# EAGLE design BLDC_Motor_Driver_mb (EAGLE 9.6.2)
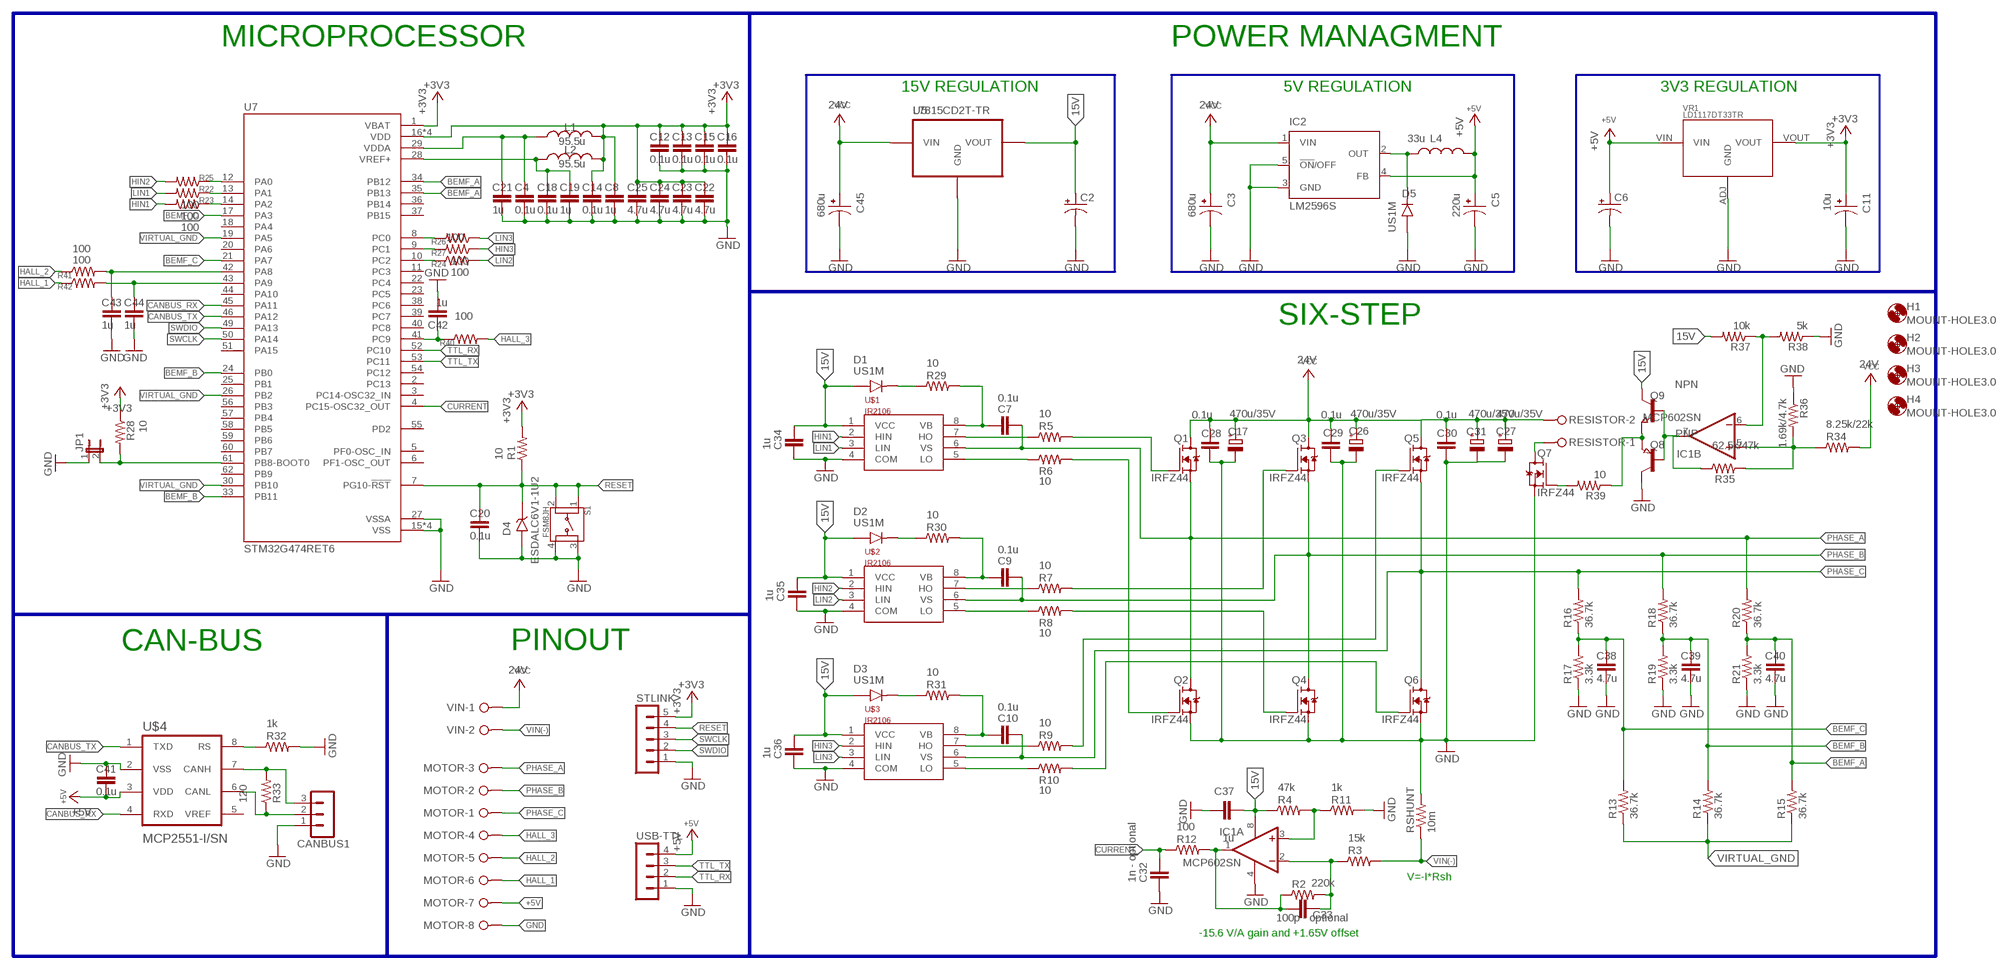
[diagram p0: schematic, sheet 1]

## Parts
C2  CPOL-US153CLV-0405  [153CLV-0405]
C3  680u  EEEFK1H221P  [CAP_EEEFK1H221P]
C4  0.1u  C-EUC1206  [C1206]
C5  220u  EEEFK1H221P  [CAP_EEEFK1H221P]
C6  CPOL-US153CLV-0405  [153CLV-0405]
C7  0.1u  C-EUC1206  [C1206]
C8  1u  C-EUC1206  [C1206]
C9  0.1u  C-EUC1206  [C1206]
C10  0.1u  C-EUC1206  [C1206]
C11  10u  EEEFK1H221P  [CAP_EEEFK1H221P]
C12  0.1u  C-EUC1206  [C1206]
C13  0.1u  C-EUC1206  [C1206]
C14  0.1u  C-EUC1206  [C1206]
C15  0.1u  C-EUC1206  [C1206]
C16  0.1u  C-EUC1206  [C1206]
C17  470u/35V  CPOL-EUE7.5-16  [E7,5-16]
C18  0.1u  C-EUC1206  [C1206]
C19  1u  C-EUC1206  [C1206]
C20  0.1u  C-EUC1206  [C1206]
C21  1u  C-EUC1206  [C1206]
C22  4.7u  C-EUC1206  [C1206]
C23  4.7u  C-EUC1206  [C1206]
C24  4.7u  C-EUC1206  [C1206]
C25  4.7u  C-EUC1206  [C1206]
C26  470u/35V  CPOL-EUE7.5-16  [E7,5-16]
C27  470u/35V  CPOL-EUE7.5-16  [E7,5-16]
C28  0.1u  C-EUC1206  [C1206]
C29  0.1u  C-EUC1206  [C1206]
C30  0.1u  C-EUC1206  [C1206]
C31  470u/35V  CPOL-EUE7.5-16  [E7,5-16]
C32  1n - optional  C-EUC1206  [C1206]
C33  100p - optional  C-EUC1206  [C1206]
C34  1u  C-EUC1206  [C1206]
C35  1u  C-EUC1206  [C1206]
C36  1u  C-EUC1206  [C1206]
C37  1u  C-EUC1206  [C1206]
C38  4.7u  C-EUC1206  [C1206]
C39  4.7u  C-EUC1206  [C1206]
C40  4.7u  C-EUC1206  [C1206]
C41  0.1u  C-EUC1206  [C1206]
C42  1u  C-EUC1206  [C1206]
C43  1u  C-EUC1206  [C1206]
C44  1u  C-EUC1206  [C1206]
C45  680u  EEEFK1H221P  [CAP_EEEFK1H221P]
CANBUS1  MA03-1  [MA03-1]
D1  US1M  [DIOM4325X250N]
D2  US1M  [DIOM4325X250N]
D3  US1M  [DIOM4325X250N]
D4  ESDALC6V1-1U2  [DIODE_ESDALC6V1-1U2]
D5  US1M  [DIOM4325X250N]
H1  MOUNT-HOLE3.0  [3,0]
H2  MOUNT-HOLE3.0  [3,0]
H3  MOUNT-HOLE3.0  [3,0]
H4  MOUNT-HOLE3.0  [3,0]
IC1  MCP602SN  [SO08]
IC2  LM2596S  [TO263-5]
JP1  JP1E  [JP1]
L1  95.5u  L-USL3225P  [L3225P]
L2  95.5u  L-USL3225P  [L3225P]
L4  33u  IHLP4040  [IHLP4040]
MOTOR  W237-08P  [W237-8P]
Q1  IRFZ44  IRFZ44NSTRRPBF  [DPAK254P1524X483-3N]
Q2  IRFZ44  IRFZ44NSTRRPBF  [DPAK254P1524X483-3N]
Q3  IRFZ44  IRFZ44NSTRRPBF  [DPAK254P1524X483-3N]
Q4  IRFZ44  IRFZ44NSTRRPBF  [DPAK254P1524X483-3N]
Q5  IRFZ44  IRFZ44NSTRRPBF  [DPAK254P1524X483-3N]
Q6  IRFZ44  IRFZ44NSTRRPBF  [DPAK254P1524X483-3N]
Q7  IRFZ44  IRFZ44NSTRRPBF  [DPAK254P1524X483-3N]
Q8  PNP  PNP-TRANSISTOR_SOT23  [SOT23]
Q9  NPN  NPN-TRANSISTOR_SOT23  [SOT23]
R1  10  R-US_R1206  [R1206]
R2  220k  R-US_R1206  [R1206]
R3  15k  R-US_R1206  [R1206]
R4  47k  R-US_R1206  [R1206]
R5  10  R-US_R1206  [R1206]
R6  10  R-US_R1206  [R1206]
R7  10  R-US_R1206  [R1206]
R8  10  R-US_R1206  [R1206]
R9  10  R-US_R1206  [R1206]
R10  10  R-US_R1206  [R1206]
R11  1k  R-US_R1206  [R1206]
R12  100  R-US_R1206  [R1206]
R13  36.7k  R-US_R1206  [R1206]
R14  36.7k  R-US_R1206  [R1206]
R15  36.7k  R-US_R1206  [R1206]
R16  36.7k  R-US_R1206  [R1206]
R17  3.3k  R-US_R1206  [R1206]
R18  36.7k  R-US_R1206  [R1206]
R19  3.3k  R-US_R1206  [R1206]
R20  36.7k  R-US_R1206  [R1206]
R21  3.3k  R-US_R1206  [R1206]
R22  100  R-US_R1206  [R1206]
R23  100  R-US_R1206  [R1206]
R24  100  R-US_R1206  [R1206]
R25  100  R-US_R1206  [R1206]
R26  100  R-US_R1206  [R1206]
R27  100  R-US_R1206  [R1206]
R28  10  R-US_R1206  [R1206]
R29  10  R-US_R1206  [R1206]
R30  10  R-US_R1206  [R1206]
R31  10  R-US_R1206  [R1206]
R32  1k  R-US_R1206  [R1206]
R33  120  R-US_R1206  [R1206]
R34  8.25k/22k  R-US_R1206  [R1206]
R35  62.5k/47k  R-US_R1206  [R1206]
R36  1.69k/4.7k  R-US_R1206  [R1206]
R37  10k  R-US_R1206  [R1206]
R38  5k  R-US_R1206  [R1206]
R39  10  R-US_R1206  [R1206]
R40  100  R-US_R1206  [R1206]
R41  100  R-US_R1206  [R1206]
R42  100  R-US_R1206  [R1206]
RESISTOR  W237-02P  [W237-132]
RSHUNT  10m  R-US_R1210  [R1210]
S1  FSM8JH  [SW_FSM8JH]
STLINK  MA05-1  [MA05-1]
U5  L7815CD2T-TR  [D2PAK]
U7  STM32G474RET6  [QFP50P1200X1200X160-64N]
U$1  IR2106  [SOIC-8]
U$2  IR2106  [SOIC-8]
U$3  IR2106  [SOIC-8]
U$4  MCP2551-I/SN  [SOIC127P599X175-8N]
USB-TTL  MA04-1  [MA04-1]
VIN  W237-02P  [W237-132]
VR1  LD1117DT33TR  [DPAK456P1010X240-3N]

## Nets
15V: C2.+ C34.2 C35.2 C36.2 C37.1 D1.A D2.A D3.A IC1.8(P:V+) Q9.3(C) R4.1 R37.2 U5.VOUT U$1.1(VCC) U$2.1(VCC) U$3.1(VCC)
+3V3: C8.1 C11.1 C12.1 C13.1 C14.1 C15.1 C16.1 C22.1 C23.1 C24.1 C25.1 L1.2 L2.2 R1.2 R28.1 STLINK.5 U7.1(VBAT) U7.16(VDD) U7.32(VDD) U7.48(VDD) U7.64(VDD) VR1.VOUT
+5V: C5.1 C6.+ C41.2 IC2.4(FB) L4.2 MOTOR.7 U$4.3(VDD) USB-TTL.4 VR1.VIN
BEMF_A: C40.1 R15.2 R20.1 R21.2 U7.34(PB12) U7.35(PB13)
BEMF_B: C39.1 R14.2 R18.1 R19.2 U7.24(PB0) U7.33(PB11)
BEMF_C: C38.1 R13.2 R16.1 R17.2 U7.17(PA3) U7.21(PA7)
CANBUS_RX: U7.45(PA11) U$4.4(RXD)
CANBUS_TX: U7.46(PA12) U$4.1(TXD)
CURRENT: C32.2 R12.1 U7.4(PC15-OSC32_OUT)
GND: C2.- C3.2 C4.2 C5.2 C6.- C8.2 C11.2 C12.2 C13.2 C14.2 C15.2 C16.2 C17.- C18.2 C19.2 C20.2 C21.2 C22.2 C23.2 C24.2 C25.2 C26.- C27.- C28.2 C29.2 C30.2 C31.- C32.1 C34.1 C35.1 C36.1 C37.2 C38.2 C39.2 C40.2 C41.1 C42.2 C43.2 C44.2 C45.2 CANBUS1.1 D4.2(A) D5.A IC1.4(P:V-) IC2.3(GND) IC2.5(!ON!/OFF) JP1.1 MOTOR.8 Q2.3(S) Q4.3(S) Q6.3(S) Q7.3(S) Q8.3(C) R11.2 R17.1 R19.1 R21.1 R32.2 R36.1 R38.1 RSHUNT.2 S1.3 S1.4 STLINK.1 U5.GND U7.15(VSS) U7.27(VSSA) U7.31(VSS) U7.47(VSS) U7.63(VSS) U$1.4(COM) U$2.4(COM) U$3.4(COM) U$4.2(VSS) USB-TTL.1 VR1.ADJ(GND)
HALL_1: MOTOR.6 R42.1
HALL_2: MOTOR.5 R41.1
HALL_3: MOTOR.4 R40.2
HIN1: R23.2 U$1.2(HIN)
HIN2: R25.2 U$2.2(HIN)
HIN3: R27.1 U$3.2(HIN)
HS2: Q3.1(G) R7.2
HS3: Q5.1(G) R9.2
LIN1: R22.2 U$1.3(LIN)
LIN2: R24.2 U$2.3(LIN)
LIN3: R26.1 U$3.3(LIN)
LS1: Q2.1(G) R6.2
LS2: Q4.1(G) R8.2
LS3: Q6.1(G) R10.2
N$1: Q1.1(G) R5.2
N$2: C4.1 C21.1 L1.1 U7.29(VDDA)
N$3: R6.1 U$1.5(LO)
N$4: C9.1 R30.2 U$2.8(VB)
N$5: R5.1 U$1.7(HO)
N$6: R26.2 U7.8(PC0)
N$7: D1.C(K) R29.1
N$8: C7.1 R29.2 U$1.8(VB)
N$9: R27.2 U7.9(PC1)
N$10: R7.1 U$2.7(HO)
N$11: R8.1 U$2.5(LO)
N$12: JP1.2 R28.2 U7.61(PB8-BOOT0)
N$13: C33.1 IC1.2(A:-IN) R2.2 R3.1
N$14: IC1.3(A:+IN) R4.2 R11.1
N$15: C10.1 R31.2 U$3.8(VB)
N$16: IC1.7(B:OUT) Q8.1(B) Q9.1(B) R35.1
N$17: R9.1 U$3.7(HO)
N$18: R10.1 U$3.5(LO)
N$19: D2.C(K) R30.1
N$20: C18.1 C19.1 L2.1 U7.28(VREF+)
N$21: C33.2 IC1.1(A:OUT) R2.1 R12.2
N$22: D5.C(K) IC2.2(OUT) L4.1
N$23: R22.1 U7.13(PA1)
N$24: R23.1 U7.14(PA2)
N$25: R24.1 U7.10(PC2)
N$26: R25.1 U7.12(PA0)
N$27: D3.C(K) R31.1
N$28: R32.1 U$4.8(RS)
N$29: IC1.5(B:+IN) R34.1 R35.2 R36.2
N$30: CANBUS1.3 R33.2 U$4.7(CANH)
N$31: Q7.2(D) RESISTOR.1
N$32: CANBUS1.2 R33.1 U$4.6(CANL)
N$33: IC1.6(B:-IN) R37.1 R38.2
N$34: Q8.2(E) Q9.2(E) R39.1
N$35: Q7.1(G) R39.2
N$36: C42.1 R40.1 U7.41(PC9)
N$37: C43.1 R41.2 U7.42(PA8)
N$38: C44.1 R42.2 U7.43(PA9)
PHASE_A: C7.2 MOTOR.3 Q1.3(S) Q2.2(D) R20.2 U$1.6(VS)
PHASE_B: C9.2 MOTOR.2 Q3.3(S) Q4.2(D) R18.2 U$2.6(VS)
PHASE_C: C10.2 MOTOR.1 Q5.3(S) Q6.2(D) R16.2 U$3.6(VS)
RESET: C20.1 D4.1(K) R1.1 S1.1 S1.2 STLINK.4 U7.7(PG10-!RST)
SWCLK: STLINK.3 U7.50(PA14)
SWDIO: STLINK.2 U7.49(PA13)
TTL_RX: U7.52(PC10) USB-TTL.2
TTL_TX: U7.53(PC11) USB-TTL.3
VCC: C3.1 C17.+ C26.+ C27.+ C28.1 C29.1 C30.1 C31.+ C45.1 IC2.1(VIN) Q1.2(D) Q3.2(D) Q5.2(D) R34.2 RESISTOR.2 U5.VIN VIN.1 ; supply symbol labelled 24V
VIN(-): R3.2 RSHUNT.1 VIN.2
VIRTUAL_GND: R13.1 R14.1 R15.1 U7.19(PA5) U7.26(PB2) U7.30(PB10)
Unconnected: U7.2(PC13) U7.3(PC14-OSC32_IN) U7.5(PF0-OSC_IN) U7.6(PF1-OSC_OUT) U7.11(PC3) U7.18(PA4) U7.20(PA6) U7.22(PC4) U7.23(PC5) U7.25(PB1) U7.36(PB14) U7.37(PB15) U7.38(PC6) U7.39(PC7) U7.40(PC8) U7.44(PA10) U7.51(PA15) U7.54(PC12) U7.55(PD2) U7.56(PB3) U7.57(PB4) U7.58(PB5) U7.59(PB6) U7.60(PB7) U7.62(PB9) U$4.5(VREF)

## Buses
B$2
B$3
B$1
B$6
B$5

## Notes on the sheet
- MICROPROCESSOR | POWER MANAGMENT
- 15V REGULATION | 5V REGULATION | 3V3 REGULATION
- SIX-STEP
- CAN-BUS | PINOUT
- V=-I*Rsh
- -15.6 V/A gain and +1.65V offset

## Library data of the parts
C2 C6 = rcl:CPOL-US: POLARIZED CAPACITOR, American symbol; SPICEPREFIX: C
C3 C5 C11 C45 = EEEFK1H221P:EEEFK1H221P; CHECK_PRICES: https://www.snapeda.com/parts/EEE-FK1H221P/Panasonic+Electronic+Components/view-part/?ref=eda; DESCRIPTION: Electrolytic capacitor SMD 220 µF 50 V 20 % (Ø x H) 10 mm x 10.2 mm Panasonic EEEFK1H221P 1 pc(s); MF: Panasonic; MP: EEE-FK1H221P; PACKAGE: RADIAL-2 Panasonic; PURCHASE-URL: https://www.snapeda.com/api/url_track_click_mouser/?unipart_id=125117&manufacturer=Panasonic&part_name=EEE-FK1H221P&search_term=smd capacitor 10mm; RS_COMPONENTS_5370584P_PURCHASE_URL: https://www.snapeda.com/api/url_track_click/https%253A//uk.rs-online.com/web/p/aluminium-capacitors/5370584p//%253Futm_campaign%253Dbuynow%2526utm_medium%253Daggregator%2526utm_source%253Dsnapeda%2526cm_mmc%253Daff-_-uk-_-snapeda-_-5370584P/?unipart_id=125117&manufacturer=Panasonic&part_name=EEE-FK1H221P&search_term=smd capacitor 10mm; RS_COMPONENTS_5370584_PURCHASE_URL: https://www.snapeda.com/api/url_track_click/https%253A//uk.rs-online.com/web/p/aluminium-capacitors/5370584//%253Futm_campaign%253Dbuynow%2526utm_medium%253Daggregator%2526utm_source%253Dsnapeda%2526cm_mmc%253Daff-_-uk-_-snapeda-_-5370584/?unipart_id=125117&manufacturer=Panasonic&part_name=EEE-FK1H221P&search_term=smd capacitor 10mm; RS_COMPONENTS_7479080_PURCHASE_URL: https://www.snapeda.com/api/url_track_click/https%253A//uk.rs-online.com/web/p/aluminium-capacitors/7479080//%253Futm_campaign%253Dbuynow%2526utm_medium%253Daggregator%2526utm_source%253Dsnapeda%2526cm_mmc%253Daff-_-uk-_-snapeda-_-7479080/?unipart_id=125117&manufacturer=Panasonic&part_name=EEE-FK1H221P&search_term=smd capacitor 10mm; SNAPEDA_LINK: https://www.snapeda.com/parts/EEE-FK1H221P/Panasonic+Electronic+Components/view-part/?ref=snap
C4 C7-C10 C12-C16 C18-C25 C28-C30 C32-C44 = rcl:C-EU: CAPACITOR, European symbol; SPICEPREFIX: C
C17 C26 C27 C31 = rcl:CPOL-EU: POLARIZED CAPACITOR, European symbol; SPICEPREFIX: C
CANBUS1 = con-lstb:MA03-1: PIN HEADER; OC_FARNELL: unknown; OC_NEWARK: unknown
D1-D3 D5 = DIODE_SMD:US1M: Check availability <https://pricing.snapeda.com/parts/US1M/Taiwan%20Semiconductor/view-part?ref=eda>; AVAILABILITY: In Stock; DESCRIPTION: 75ns, 1A, 1000V, High Efficient Recovery Rectifier; MF: Taiwan Semiconductor; MP: US1M; PACKAGE: SMA-2 Taiwan Semiconductor; PRICE: None
D4 = ESDALC6V1-1U2:ESDALC6V1-1U2: Check availability <https://pricing.snapeda.com/parts/ESDALC6V1-1U2/STMicroelectronics/view-part?ref=eda>; AVAILABILITY: In Stock; CHECK_PRICES: https://www.snapeda.com/parts/ESDALC6V1-1U2/STMicroelectronics/view-part/?ref=eda; DESCRIPTION: - Clamp - Ipp Tvs Diode Surface Mount ST0201; MF: STMicroelectronics; MP: ESDALC6V1-1U2; PACKAGE: 0201 STMicroelectronics; PRICE: None; SNAPEDA_LINK: https://www.snapeda.com/parts/ESDALC6V1-1U2/STMicroelectronics/view-part/?ref=snap
H1-H4 = holes:MOUNT-HOLE: MOUNTING HOLE with drill center marker
IC1 = linear:MCP602: Single Op Amp 2.7V to 6.0V Single Supply CMOS Source: http://ww1.microchip.com/downloads/en/DeviceDoc/21314g.pdf
IC2 = national-semiconductor:LM2596: SIMPLE SWITCHER® Power Converter 150 kHz 3A Step-Down Voltage Regulator Source: http://www.national.com/ds/LM/LM2596.pdf; MF: NATIONAL SEMICONDUCTOR; MPN: LM2596S-ADJ/NOPB; OC_FARNELL: 9494367; OC_NEWARK: 41K3842
JP1 = jumper:JP1E: JUMPER
L1 L2 = rcl:L-US: INDUCTOR, American symbol; SPICEPREFIX: L
L4 = smd-inductors:IHLP4040
MOTOR = con-wago-508:W237-08P: WAGO SREW CLAMP; OC_FARNELL: unknown; OC_NEWARK: unknown
Q1-Q7 = IRFZ44NSTRRPBF:IRFZ44NSTRRPBF: N-Channel 55V 49A (Tc) 3.8W (Ta), 94W (Tc) Surface Mount D2PAK Check availability <https://pricing.snapeda.com/parts/IRFZ44NSTRRPBF/Infineon%20Technologies/view-part?ref=eda>; AVAILABILITY: In Stock; CHECK_PRICES: https://www.snapeda.com/parts/IRFZ44NSTRRPBF/Infineon+Technologies/view-part/?ref=eda; DESCRIPTION: RoHS Compliant | Low RDS(on) | Industry-leading quality | Dynamic dv/dt Rating | Fast Switching | Fully Avalanche Rated | 175C Operating Temperature; MF: Infineon Technologies; MP: IRFZ44NSTRRPBF; PACKAGE: D2PAK Infineon; PRICE: None; SNAPEDA_LINK: https://www.snapeda.com/parts/IRFZ44NSTRRPBF/Infineon+Technologies/view-part/?ref=snap
Q8 = semicon-smd-ipc:PNP-TRANSISTOR_: PNP TRANSISTOR
Q9 = semicon-smd-ipc:NPN-TRANSISTOR_: NPN TRANSISTOR
R1-R42 RSHUNT = rcl:R-US_: RESISTOR, American symbol; SPICEPREFIX: R
RESISTOR VIN = con-wago-508:W237-02P: WAGO SREW CLAMP; OC_FARNELL: unknown; OC_NEWARK: unknown
S1 = PUSH_BUTTON:FSM8JH: Switch, Pushbutton, Tactile, SPST, Thru Hole, Vertical, 6MM, Black Check availability <https://pricing.snapeda.com/parts/FSM8JH/TE%20Connectivity/view-part?ref=eda>; AVAILABILITY: In Stock; CHECK_PRICES: https://www.snapeda.com/parts/FSM8JH/TE+Connectivity+ALCOSWITCH+Switches/view-part/?ref=eda; DESCRIPTION: Switch,Pushbutton,Tactile,SPST,Thru Hole,Vertical,6MM,Black | TE Connectivity FSM8JH; MF: TE Connectivity; MP: FSM8JH; PACKAGE: None; PRICE: None; SNAPEDA_LINK: https://www.snapeda.com/parts/FSM8JH/TE+Connectivity+ALCOSWITCH+Switches/view-part/?ref=snap
STLINK = con-lstb:MA05-1: PIN HEADER; OC_FARNELL: unknown; OC_NEWARK: unknown
U5 = L7815CD2T-TR:L7815CD2T-TR: http://www.mouser.com/ProductDetail/STMicroelectronics/L4940D2T12-TR/?qs=sGAEpiMZZMsGz1a6aV8DcKREcVcP%2fiKiVDVM5jQw8rM%3d Check availability <https://pricing.snapeda.com/parts/L7815CD2T-TR/STMicroelectronics/view-part?ref=eda>; AVAILABILITY: In Stock; CHECK_PRICES: https://www.snapeda.com/parts/L7815CD2T-TR/STMicroelectronics/view-part/?ref=eda; DESCRIPTION: Linear Voltage Regulator IC Positive Fixed 1 Output 1.5A D2PAK; MF: STMicroelectronics; MP: L7815CD2T-TR; PACKAGE: D2PAK STMicroelectronics; PRICE: None; SNAPEDA_LINK: https://www.snapeda.com/parts/L7815CD2T-TR/STMicroelectronics/view-part/?ref=snap
U7 = STM32G474RET6:STM32G474RET6; CHECK_PRICES: https://www.snapeda.com/parts/STM32G474RET6/STMicroelectronics/view-part/?ref=eda; DESCRIPTION: ARM® Cortex®-M4F STM32G4 Microcontroller IC 32-Bit Single-Core 170MHz 512KB (512K x 8) FLASH 64-LQFP (10x10); DIGIKEY_PART_NUMBER: 497-STM32G474RET6-ND; MF: STMicroelectronics; MP: STM32G474RET6; PACKAGE: LQFP-64 STMicroelectronics; SNAPEDA_LINK: https://www.snapeda.com/parts/STM32G474RET6/STMicroelectronics/view-part/?ref=snap
U$1-U$3 = mutlu:IR2106
U$4 = MCP2551-I_SN:MCP2551-I/SN: Check availability <https://pricing.snapeda.com/parts/MCP2551-I/SN/Microchip/view-part?ref=eda>; AVAILABILITY: In Stock; CHECK_PRICES: https://www.snapeda.com/parts/MCP2551-I/SN/Microchip/view-part/?ref=eda; DESCRIPTION: Microchip CAN Transceiver1Mbit/s 1-channel ISO 11898 8-Pin SOIC | Microchip Technology Inc. MCP2551-I/SN; MF: Microchip; MP: MCP2551-I/SN; PACKAGE: SOIC-8 Microchip; PRICE: None; PURCHASE-URL: https://www.snapeda.com/api/url_track_click_mouser/?unipart_id=10929&manufacturer=Microchip&part_name=MCP2551-I/SN&search_term=mcp2551; SNAPEDA_LINK: https://www.snapeda.com/parts/MCP2551-I/SN/Microchip/view-part/?ref=snap
USB-TTL = con-lstb:MA04-1: PIN HEADER; OC_FARNELL: unknown; OC_NEWARK: unknown
VR1 = LD1117DT33TR:LD1117DT33TR: LD1117 Series 1300 mA 3.3 V Fixed SMT Positive Voltage Regulator - TO-252 Check availability <https://pricing.snapeda.com/parts/LD1117DT33TR/STMicroelectronics/view-part?ref=eda>; AVAILABILITY: In Stock; CHECK_PRICES: https://www.snapeda.com/parts/LD1117DT33TR/STMicroelectronics/view-part/?ref=eda; DESCRIPTION: Linear Voltage Regulator IC Positive Fixed 1 Output 800mA DPAK; MF: STMicroelectronics; MP: LD1117DT33TR; PACKAGE: DPAK STMicroelectronics; PRICE: None; SNAPEDA_LINK: https://www.snapeda.com/parts/LD1117DT33TR/STMicroelectronics/view-part/?ref=snap

## Board
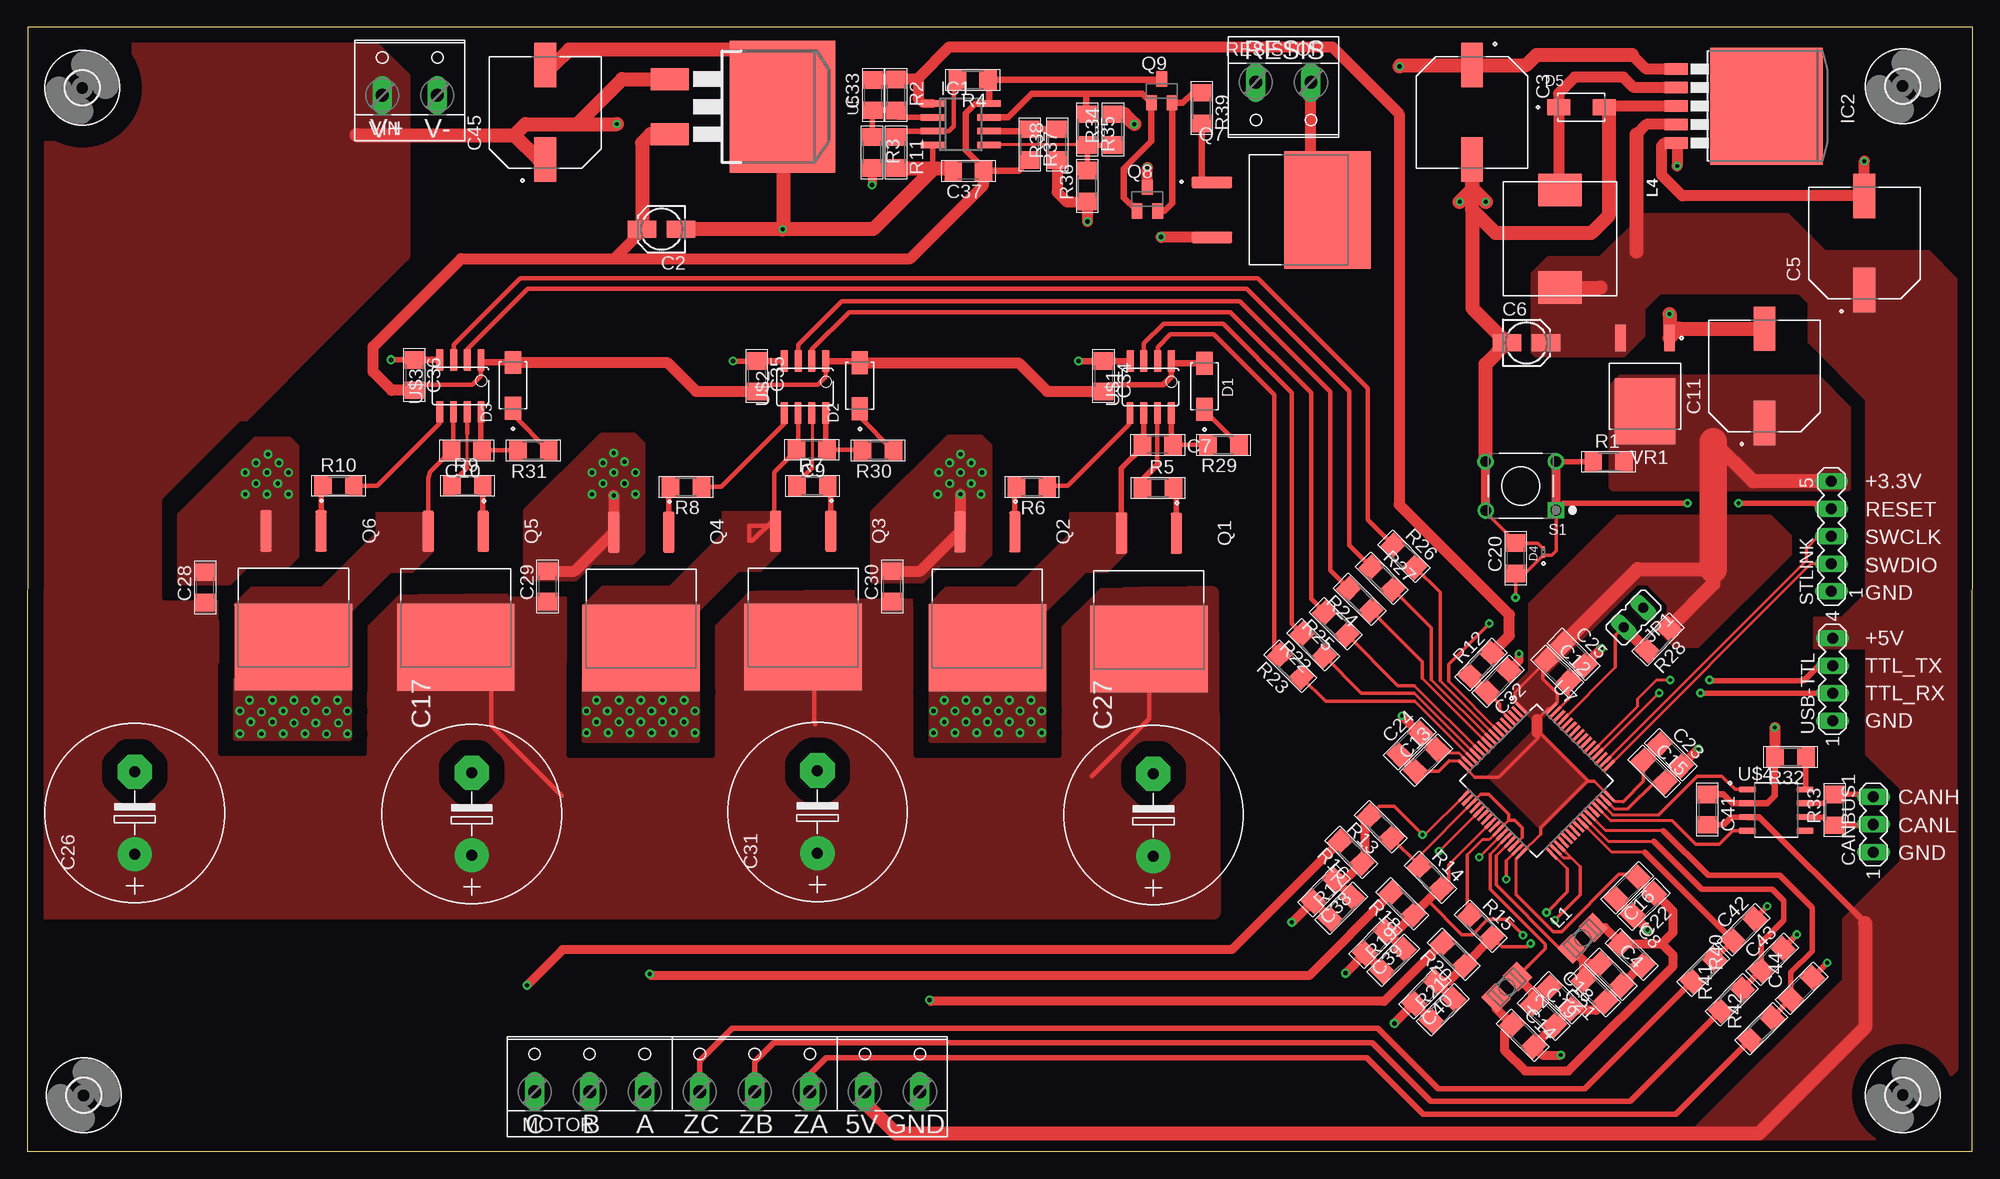
[diagram p1: board, top side]
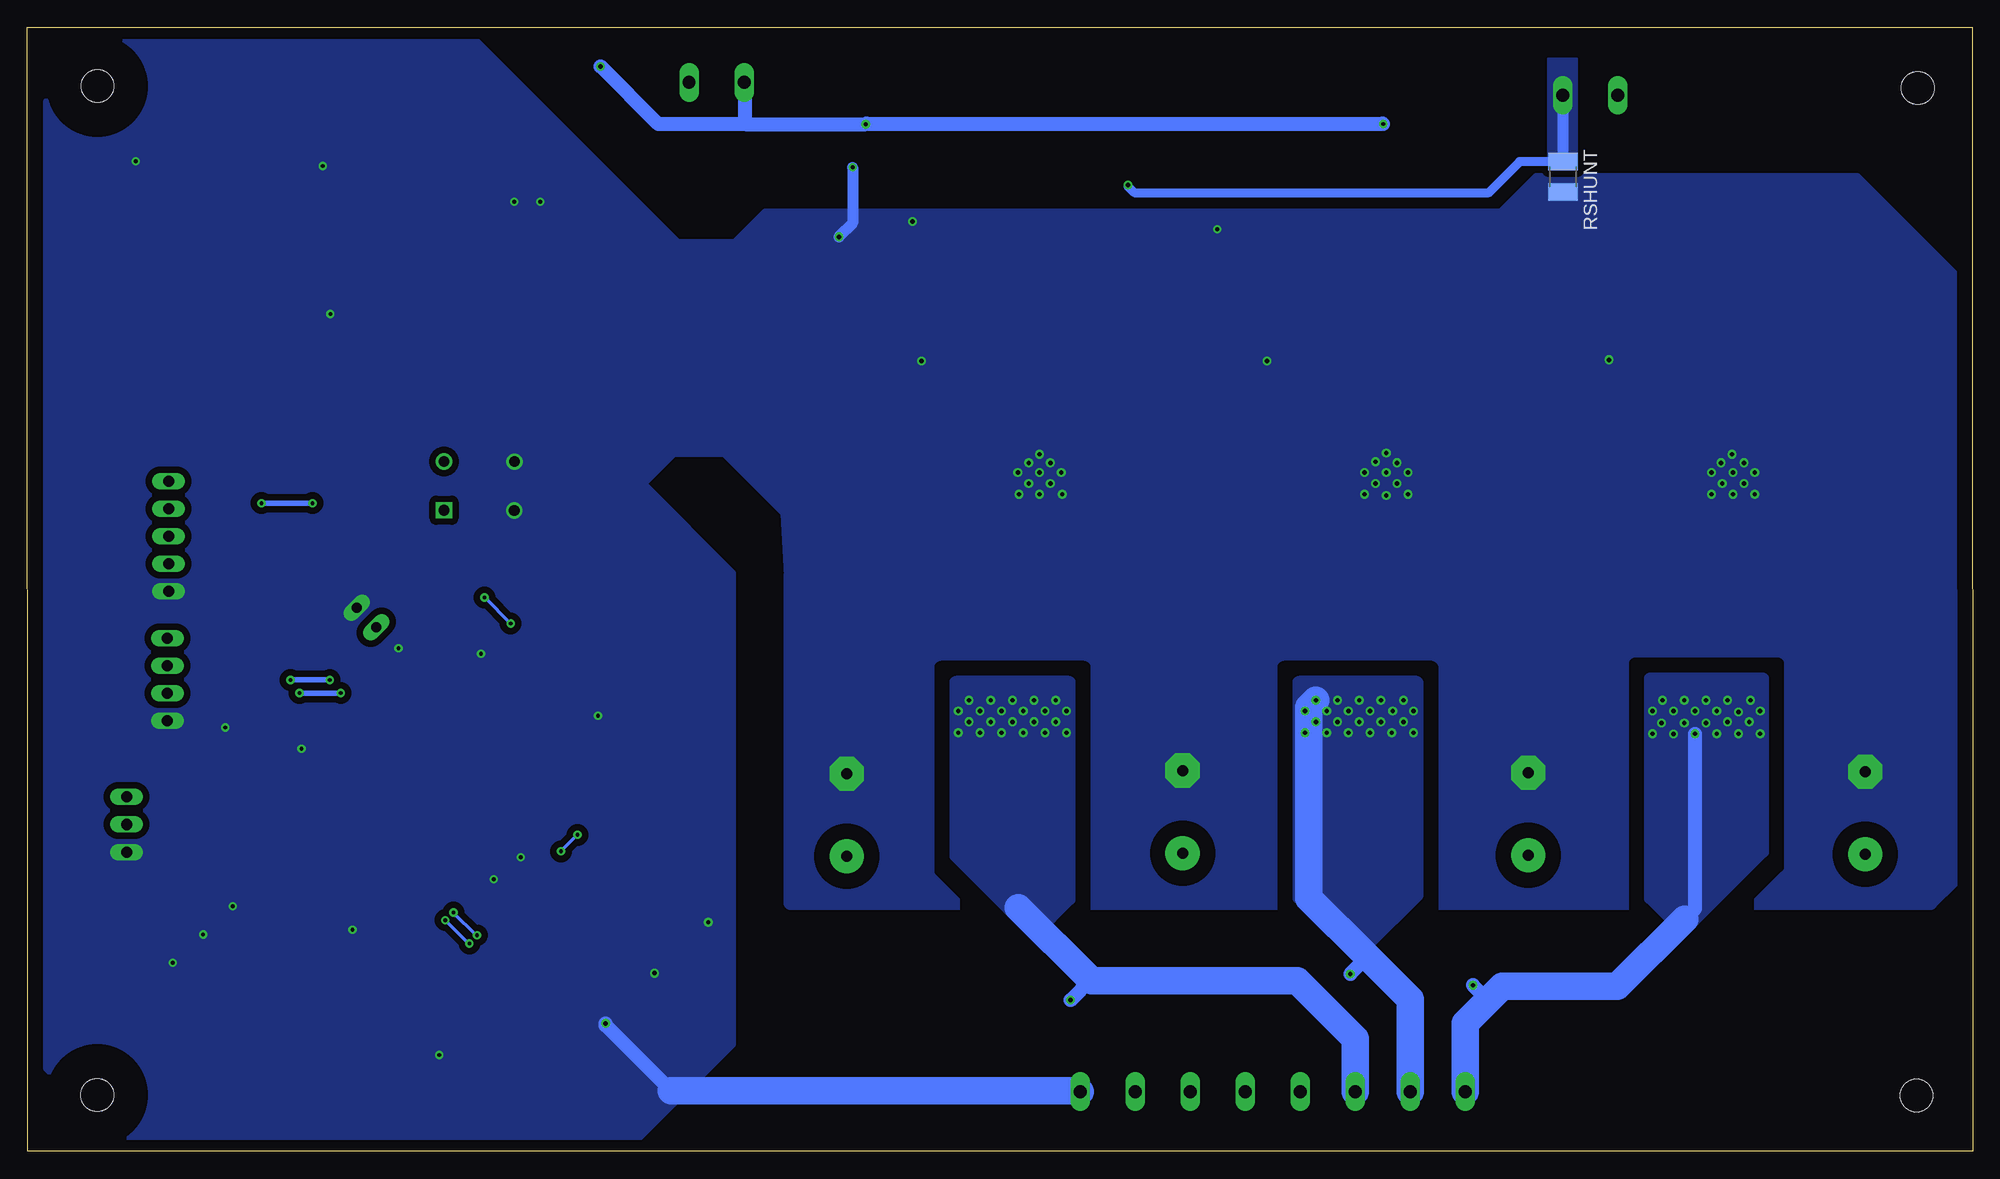
[diagram p2: board, bottom side, seen from below]

Size 179.56 x 103.76 mm. Coordinates in mm from the lower left corner, seen from the top.
Outline: 0,0.01 179.53,0 179.56,103.75 0.04,103.76 0,0.01
Copper layers (1*16): Top 0.035mm / dielectric 1.5mm / Bottom 0.035mm
Design rules "default *": minimum track width 6mil, minimum drill 0.35mm, track to track 6mil, track to pad 6mil, pad to pad 7mil, via to via 6mil, smd to smd 6mil, copper to edge 40mil, drill to drill 6mil, minimum pad ring 10mil, minimum via ring 8mil, stop-mask expansion 4mil, vias tented up to drill 0mil, thermal gap 10mil

### Footprints (pad centres in the part's own frame; a part is rotated, then mirrored left to right if it is on the bottom)
153CLV-0405 = smd 2.6 x 1.6: + 1.8,0; - -1.8,0
CAP_EEEFK1H221P = smd 4.1 x 2: 1 -4.35,0; 2 4.35,0
C1206 = smd 1.6 x 1.8: 1 -1.4,0; 2 1.4,0
E7,5-16 = drill 1.016 pad 3.15: + -3.81,0 | drill 1.016 pad 3.15 octagon: - 3.81,0
MA03-1 = drill 1.016 long: 1 -2.54,0; 2 0,0; 3 2.54,0
DIOM4325X250N = smd 2.12 x 1.5: A 2.115,0; C -2.115,0
DIODE_ESDALC6V1-1U2 = smd 0.425 x 0.3: 1 -0.312,0; 2 0.312,0
3,0 = hole 3: 0,0
SO08 = smd 0.6 x 2.2: 1 -1.905,-2.6; 2 -0.635,-2.6; 3 0.635,-2.6; 4 1.905,-2.6; 5 1.905,2.6; 6 0.635,2.6; 7 -0.635,2.6; 8 -1.905,2.6
TO263-5 = smd 1.067 x 2.159: 1 -3.404,-5.791; 2 -1.702,-5.791; 3 0,-5.791; 4 1.702,-5.791; 5 3.404,-5.791 | smd 10.8 x 10.41: 6 0,2.54
JP1 = drill 0.914 long: 1 0,-1.27; 2 0,1.27
L3225P = smd 1.8 x 2: 1 -1.4,0; 2 1.4,0
IHLP4040 = smd 3 x 4: 1 -4.5,0; 2 4.5,0
W237-8P = drill 1.194 long: 1 -17.78,-0.635; 2 -12.7,-0.635; 3 -7.62,-0.635; 4 -2.54,-0.635; 5 2.54,-0.635; 6 7.62,-0.635; 7 12.7,-0.635; 8 17.78,-0.635
DPAK254P1524X483-3N = smd 3.78 x 1.06: 1 -6.4,2.54; 3 -6.4,-2.54 | smd 8 x 10.84: 2 4.29,0
SOT23 = smd 1 x 1.4: 1 -0.95,-1.1; 2 0.95,-1.1; 3 0,1.1
R1206 = smd 1.6 x 1.803: 1 -1.422,0; 2 1.422,0
W237-132 = drill 1.194 long: 1 -2.54,-0.635; 2 2.54,-0.635
R1210 = smd 1.6 x 2.7: 1 -1.4,0; 2 1.4,0
SW_FSM8JH = drill 0.99 square: 1 -3.25,2.25 | drill 0.99: 2 -3.25,-2.25; 3 3.25,2.25; 4 3.25,-2.25
MA05-1 = drill 1.016 long: 1 -5.08,0; 2 -2.54,0; 3 0,0; 4 2.54,0; 5 5.08,0
D2PAK = smd 12.2 x 9.75: GND 0,1.5 | smd 2 x 3.5: VIN -2.54,-8.89; VOUT 2.54,-8.89
QFP50P1200X1200X160-64N = smd 1.47 x 0.28: 1 -5.67,3.75; 2 -5.67,3.25; 3 -5.67,2.75; 4 -5.67,2.25; 5 -5.67,1.75; 6 -5.67,1.25; 7 -5.67,0.75; 8 -5.67,0.25; 9 -5.67,-0.25; 10 -5.67,-0.75; 11 -5.67,-1.25; 12 -5.67,-1.75; 13 -5.67,-2.25; 14 -5.67,-2.75; 15 -5.67,-3.25; 16 -5.67,-3.75; 33 5.67,-3.75; 34 5.67,-3.25; 35 5.67,-2.75; 36 5.67,-2.25; 37 5.67,-1.75; 38 5.67,-1.25; 39 5.67,-0.75; 40 5.67,-0.25; 41 5.67,0.25; 42 5.67,0.75; 43 5.67,1.25; 44 5.67,1.75; 45 5.67,2.25; 46 5.67,2.75; 47 5.67,3.25; 48 5.67,3.75 | smd 0.28 x 1.47: 17 -3.75,-5.67; 18 -3.25,-5.67; 19 -2.75,-5.67; 20 -2.25,-5.67; 21 -1.75,-5.67; 22 -1.25,-5.67; 23 -0.75,-5.67; 24 -0.25,-5.67; 25 0.25,-5.67; 26 0.75,-5.67; 27 1.25,-5.67; 28 1.75,-5.67; 29 2.25,-5.67; 30 2.75,-5.67; 31 3.25,-5.67; 32 3.75,-5.67; 49 3.75,5.67; 50 3.25,5.67; 51 2.75,5.67; 52 2.25,5.67; 53 1.75,5.67; 54 1.25,5.67; 55 0.75,5.67; 56 0.25,5.67; 57 -0.25,5.67; 58 -0.75,5.67; 59 -1.25,5.67; 60 -1.75,5.67; 61 -2.25,5.67; 62 -2.75,5.67; 63 -3.25,5.67; 64 -3.75,5.67
SOIC-8 = smd 0.635 x 1.956: 1 -1.651,-2.392; 2 -0.391,-2.392; 3 0.879,-2.392; 4 2.149,-2.392; 5 2.159,2.392; 6 0.889,2.392; 7 -0.381,2.392; 8 -1.651,2.392
SOIC127P599X175-8N = smd 1.58 x 0.6: 1 -2.67,1.905; 2 -2.67,0.635; 3 -2.67,-0.635; 4 -2.67,-1.905; 5 2.67,-1.905; 6 2.67,-0.635; 7 2.67,0.635; 8 2.67,1.905
MA04-1 = drill 1.016 long: 1 -3.81,0; 2 -1.27,0; 3 1.27,0; 4 3.81,0
DPAK456P1010X240-3N = smd 2.44 x 0.97: ADJ -4.29,2.28; VIN -4.29,-2.28 | smd 6.07 x 5.55: VOUT 2.48,0

### Placement (x,y rotation side)
C2  58.55,85.1 180 top
C3  133.35,95.89 270 top
C4  146.16,16.35 315 top
C5  169.54,83.83 90 top
C6  138.37,74.62 0 top
C7  104.34,65.2 180 top
C8  148.08,18.18 315 top
C9  72.41,64.75 180 top
C10  40.58,64.69 180 top
C11  160.34,71.57 90 top
C12  141.22,44.34 315 top
C13  129.12,36.09 45 top
C14  138.03,10.71 315 top
C15  150.15,35.07 315 top
C16  147.66,24.32 225 top
C17  41.03,31.14 90 top
C18  141.48,14.17 315 top
C19  139.96,12.64 315 top
C20  137.37,54.74 90 top
C21  144.63,14.82 315 top
C22  149.18,22.79 225 top
C23  151.67,36.6 315 top
C24  127.6,37.62 45 top
C25  142.74,45.86 315 top
C26  9.94,31.24 90 top
C27  103.94,31.04 90 top
C28  16.44,52.04 90 top
C29  48.03,52.14 90 top
C30  79.84,52.14 90 top
C31  72.94,31.34 90 top
C32  135.74,43.4 225.6 top
C33  78.08,97.49 90 top
C34  99.34,71.54 270 top
C35  67.34,71.54 270 top
C36  35.73,71.64 270 top
C37  86.87,90.49 180 top
C38  119.67,24.08 225.4 top
C39  124.42,19.32 225.6 top
C40  129.01,14.67 225.3 top
C41  155.05,31.55 270 top
C42  158.43,20.46 45 top
C43  161.04,17.73 45 top
C44  163.77,15.06 45 top
C45  47.82,95.89 90 top
CANBUS1  170.37,30.17 90 top
D1  108.65,70.63 90 top
D2  76.85,70.66 90 top
D3  44.85,70.69 90 top
D4  139.93,55.32 89.9 top
D5  143.44,96.36 0 top
H1  5.22,5.17 0 top
H2  5.09,98.15 0 top
H3  173.08,98.31 0 top
H4  173.09,5.2 0 top
IC1  86.17,94.79 270 top
IC2  157.98,96.47 270 top
JP1  148.23,49.29 135 top
L1  143.55,19.67 45 top
L2  136.54,15.15 225 top
L4  141.46,84.23 270 top
MOTOR  64.62,6.16 0 top
Q1  103.52,50.65 270 top
Q2  88.62,50.78 270 top
Q3  71.62,50.85 270 top
Q4  56.67,50.75 270 top
Q5  39.56,50.82 270 top
Q6  24.58,50.85 270 top
Q7  115.73,86.89 0 top
Q8  103.38,87.89 0 top
Q9  104.71,97.86 0 top
R1  145.95,63.64 0 top
R2  80.18,97.49 270 top
R3  77.98,92.19 270 top
R4  87.27,98.89 180 top
R5  104.36,61.22 0 top
R6  92.73,61.31 180 top
R7  72.46,61.41 0 top
R8  60.8,61.32 180 top
R9  40.63,61.43 0 top
R10  28.73,61.43 180 top
R11  80.18,92.19 270 top
R12  134.15,44.93 46.2 top
R13  124.9,29.97 135 top
R14  129.5,25.3 314.8 top
R15  134.17,20.77 315 top
R16  122.18,27.61 135 top
R17  121.28,22.46 45.1 top
R18  126.91,22.86 135.2 top
R19  126.06,17.66 45.2 top
R20  131.66,18.2 134.8 top
R21  130.65,13.05 45.1 top
R22  118.68,46.75 135 top
R23  116.59,44.78 135 top
R24  122.99,50.94 135 top
R25  120.78,48.71 135 top
R26  127.06,54.94 315 top
R27  125.03,52.91 315 top
R28  150.51,47.23 225.9 top
R29  110.4,65.2 180 top
R30  78.53,64.69 180 top
R31  46.71,64.68 180 top
R32  162.74,36.4 180 top
R33  166.81,31.52 90 top
R34  100.22,94.29 90 top
R35  97.83,94.29 270 top
R36  97.83,89.09 90 top
R37  92.52,92.91 270 top
R38  95.06,92.91 90 top
R39  108.39,96.28 270 top
R40  154.69,16.71 225 top
R41  157.29,13.98 45 top
R42  160.02,11.31 45 top
RESISTOR  115.94,98.03 180 top
RSHUNT  37.83,89.94 270 bottom
S1  137.85,61.41 180.1 top
STLINK  166.5,56.76 90 top
U5  68.2,96.41 270 top
U7  139.29,34.2 315 top
U$1  103.94,70.54 180 top
U$2  72.04,70.54 180 top
U$3  40.23,70.64 180 top
U$4  161.41,31.5 0 top
USB-TTL  166.62,43.57 90 top
VIN  35.32,98.1 0 top
VR1  149.31,70.79 270 top

### Tracks (layer width: path | path; a pad name or v marks a point on that pad's centre or on a via)
15V
  Top 0.406: C35.2 67.94,70.74 72.95,70.74 73.69,71.48 U$2.1 | D2.A 76.69,72.94 | C36.2 36.23,70.74 41.08,70.74 41.89,71.55 U$3.1 42.12,72.81 | C37.1 88.52,90.49
  Top 0.508: U$1.1 105.59,72.64 | 105.59,72.64 105.59,71.5 104.84,70.74 99.94,70.74 C34.2 | 105.69,72.74 105.59,72.64
  Top 0.61: D1.A 105.69,72.74 | 76.69,72.94 U$2.1 | D3.A 42.12,72.81 | 88.52,90.49 86.62,92.39 86.62,95.82 87.5,96.69 IC1.8 88.77,98.81 R4.1 104.64,98.89 Q9.3 | C37.1 91.52,90.49 R37.2
  Top 1.016: C35.2 61.73,70.14 59.07,72.81 D3.A | D2.A 91.5,72.78 94.14,70.14 C34.2 | C36.2 33.63,70.24 31.94,71.94 31.94,74.28 40.05,82.4 54.17,82.4 | 54.17,82.4 81.5,82.4 88.27,89.17 C37.1 | 56.75,84.98 54.17,82.4
  Top 1.27: U5.VOUT 57.54,93.87 56.75,93.08 C2.+ 56.75,84.98
+3V3
  Top 0.203: 132.63,35.53 U7.16
  Top 0.254: 141.22,41.44 U7.64 140.33,40.86 139.32,39.85 | 147.29,32.27 146.52,32.27 U7.48 144.62,34.18 | 131.25,36.08 132.11,36.08 U7.16 | C12.1 140.23,45.26 137.29,42.32 137.29,41.51 U7.1 | 133.6,34.55 132.63,35.53 | 139.7,29.28 139.68,29.28 U7.32 137.43,27.03 137.43,23.68
  Top 0.305: C16.1 148.39,25.56 146.9,25.56 141.6,20.27 140.84,20.27 137.43,23.68 | 141.22,41.44 141.22,42.3 139.89,43.63 139.89,44.99 C12.1 | 147.29,32.27 149.16,34.14 C15.1 | C13.1 130.28,35.1 131.25,36.08 | 139.44,38.77 139.44,38.2 135.8,34.55 133.6,34.55 | 139.32,38.64 139.44,38.77 | 139.44,38.77 139.45,38.78 144.05,34.18 | 144.62,34.18 144.05,34.18 | 144.05,34.18 143.98,34.18 139.7,29.89 139.7,29.28
  Top 0.813: L2.2 135.55,13.19 C14.1 136.33,11 136.33,9.34 138.24,7.44 142.24,7.44 151.89,17.09 151.89,18.11 150.83,19.17 | L1.2 145.6,20.66 C8.1 150.83,19.17 | 150.83,19.17 151.89,20.23 151.89,22.17 150.28,23.78 C22.1 C16.1 | C13.1 C24.1
  Top 1.016: C15.1 C23.1 | 139.32,39.85 139.32,38.64
  Top 1.27: C12.1 C25.1 148.63,53.73 155.61,53.73 155.61,52.37 R28.1 | STLINK.5 159.27,61.84 155.61,65.5
  Top 2.54: 155.61,65.5 155.61,53.73
  pour Top: 134.87,34.62 138.94,38.68 139.57,38.68 144.02,34.24 144.02,34.17 139.67,29.82
  pour Top (no thermals): 146.24,61.35 146.37,61.22 168.02,61.22 168.02,68.59 165.23,71.38 147.07,71.38 146.24,70.56
  pour Top (no thermals): 139.32,43.7 138.68,44.33 138.68,50.49 146.81,58.62 160.85,58.62 162.69,56.78 162.69,55.13 154.18,46.62 152.02,46.62 150.37,48.27 150.37,48.65 151.45,49.73 151.45,50.49 149.54,52.4 148.53,52.4 139.83,43.7
  pour Top (no thermals): 137.99,40.84 137.29,41.54 137.29,42.3 137.29,42.94 138.68,44.33 139.19,44.33 141.22,42.3 141.22,41.41 139.7,39.89 139,39.89 138.94,39.89
+5V
  Top 0.508: C41.2 156.57,30.15 157.28,30.86 U$4.3
  Top 0.61: U$4.3 159.84,30.86 169.61,21.09
  Top 1.016: IC2.4 149.44,94.77 148.53,93.86
  Top 1.27: MOTOR.7 77.32,4.51 80.17,1.66 159.83,1.66 169.61,11.44 169.61,21.09 | 148.53,83.07 148.53,93.86 | L4.2 145.19,79.73
  pour Top (no thermals): 164.59,81.67 164.59,74.75 169.93,69.41 169.93,36.71 174.18,32.46 177.86,32.46 177.86,80.46 175.45,82.88 165.8,82.88
  pour Top (isolate 0.61, no thermals): 172.97,33.47 172.97,26.74 167.64,21.41 167.64,15.82 153.86,2.04 153.86,1.34 154.11,1.09 171.58,1.09 178.05,7.57 178.05,32.59 176.97,33.66 173.16,33.66
  pour Top (no thermals): 171.51,46.49 164.97,46.49 164.97,49.22 167.51,49.22 170.56,52.27 171.51,52.27
  pour Top (no thermals): 164.59,78.37 163.64,79.32 150.56,79.32 149.1,77.86 149.1,75.38 147.26,73.54 139.32,73.54 139,73.86 139,80.91 140.46,82.37 145.29,82.37 149.29,86.37 162.37,86.37 165.86,82.88 165.86,78.62 165.61,78.37
BEMF_A  (via drill 0.35)
  Top 0.254: U7.35 142.49,27.12 | 142.49,27.12 143.32,26.29 | U7.34 141.78,27.12 142.49,27.12
  Top 0.305: 143.32,26.29 143.32,23.69 v140.97,21.35 | v138.75,19.19 138.43,18.87 136.07,18.87 R15.2
  Top 0.813: R15.2 135.17,19.7 R20.1 131.14,15.66 C40.1 130.05,15.66 R21.2
  Bottom 0.305: v140.97,21.35 138.81,19.19 v138.75,19.19
BEMF_B  (via drill 0.35)
  Top 0.254: U7.24 131.19,26.46 | 142.11,26.08 U7.33
  Top 0.305: R14.2 131.19,24.97 131.19,26.46 | v140.22,22.05 142.11,23.95 142.11,26.08 | v138.05,19.95 136.59,21.41 134.81,21.41 133.41,20.01 132.4,20.01 129.24,23.17
  Top 0.813: R14.2 130.35,24.29 129.24,23.17 R18.1 126.4,20.33 125.41,20.33 C39.1 125.41,20.32 R19.2
  Bottom 0.305: v140.22,22.05 138.11,19.95 v138.05,19.95
BEMF_C  (via drill 0.35)
  Top 0.254: U7.21 v130.31,27.7 | U7.17 129.04,29.26 129.04,29.23
  Top 0.305: R13.2 124.76,31.84 126.16,31.84 v128.78,29.22 128.79,29.23 129.04,29.23 | v130.31,27.7 v130.3,27.7
  Top 0.813: R13.2 123.9,30.94 123.44,30.48 123.44,26.86 R16.1 121.66,25.08 C38.1 122.27,23.47 R17.2
  Bottom 0.305: v130.3,27.7 v128.78,29.22
CANBUS_RX
  Top 0.254: U7.45 146.16,30.51 151.81,30.51
  Top 0.305: 151.81,30.51 154,28.33 156.15,28.33 157.41,29.59 U$4.4
CANBUS_TX
  Top 0.254: U7.46 146.32,31.06 150.56,31.06
  Top 0.305: 150.56,31.06 154.11,34.62 156.4,34.62 157.61,33.4 U$4.1
CURRENT
  Top 0.254: 135.89,40.79 U7.4
  Top 0.305: C32.2 135.89,41.27 135.89,40.79
  Top 0.813: R12.1 134.67,42.4 C32.2
GND  (via drill 0.35, 0.4)
  Top 0.254: U7.31 136.5,26.82 | U7.27 v134.02,27.16 | U7.63 142.21,41.71 | U7.47 146.46,31.63 147.73,31.63 | U7.15 132.12,36.78 130.42,36.78
  Top 0.305: v134.02,27.16 | 142.21,41.71 C12.2 | C15.2 150.18,34.08 147.73,31.63 | C13.2 130.42,36.78 | v136.49,25.12 v136.5,25.13 136.5,26.82 | D4.2 139.42,56.14 C20.2 137.37,56.2 134.6,58.97 S1.3
  Top 0.406: R11.2 80.75,90.77 80.82,90.69 | C37.2 85.27,90.69 | U$3.4
  Top 0.508: U$1.4 | IC1.4 83.57,90.79 83.47,90.69 | R36.1 97.85,87.64 | R32.2 161.29,36.38 | C43.2 v163.32,20.01 | C42.2 v160.59,22.62 | C44.2 v166.12,17.41 | C35.1 v65.14,72.94 | C36.1 v33.58,73.04 v33.58,73.05
  Top 0.61: U$1.4 C34.1 v97.04,72.94 | U$3.4 C36.1 | U$2.4 C35.1 | C41.1 156.54,32.95 157.36,32.13 U$4.2 160.58,32.13 161.29,32.84 161.29,36.38
  Top 0.813: R17.1 120.27,21.5 C38.2 116.76,21.15 v116.71,21.16 | R19.1 125.05,16.7 C39.2 123.44,18.23 v121.67,16.46 | R21.1 C40.2 v126.18,11.82 | C12.2 C25.2 v145.29,46.43 | v145.29,46.43 | C15.2 C23.2 154.21,37.16 v154.24,37.16 | C13.2 C24.2 128.47,38.61 v126.87,40.2 | C16.2 C22.2 v149.54,20.46 | v149.54,20.46 | C8.2 148.97,17.19 C4.2 C21.2 144.79,13.01 142.64,13.01 C18.2 C19.2 C14.2 139.84,8.9 v141.54,8.9 | v137.67,45.92 137.67,45.29 136.78,44.4 C32.1 | S1.3 134.59,59.17 S1.4
  Top 1.016: C29.2 50.52,53.54 Q4.3 v54.13,60.54 | C30.2 82.44,53.54 Q2.3 86.14,57.24 v86.14,60.64 | C35.1 | v97.85,85.81 97.85,87.64 95.95,87.64 95.06,88.53 R38.1 | Q7.3 104.7,84.35 v104.65,84.4 | R32.2 161.31,39.1 v161.29,39.13 | IC2.3 145.67,96.47 D5.A | v152.27,90.94 152.27,92.98 IC2.5 151.1,93.07 150.81,92.78 150.81,90.12 152.75,88.18 C5.2 v169.54,91.39 | Q8.3 v103.38,90.81
  Top 1.27: 83.67,90.69 83.47,90.69 80.82,90.69 | 85.27,90.69 83.67,90.69 | 83.67,90.69 78.08,85.11 69.77,85.11 69.77,85.5 | 69.77,85.5 69.77,96.35 U5.GND 70.08,96.79 70.08,96.95 65.35,101.68 50.02,101.68 48.58,100.24 C45.2 | D5.A 145.94,95.97 145.94,86.35 144.33,84.74 135.52,84.74 133.37,86.9 | v151.57,77.29 151.57,75.09 VR1.ADJ 152.43,75.92 C11.2 | 69.77,85.5 69.72,85.46 v69.72,85.1 C2.- | 133.37,86.9 133.35,86.92 C3.2 | C3.2 133.35,88.78 v132.21,87.64 | C3.2 133.35,88.88 134.59,87.64 v134.62,87.64 | 133.37,86.9 133.37,77.82 C6.- 134.59,72.65 S1.4
  Bottom 1.016: v103.38,90.81 103.38,85.67 v104.65,84.4
  Bottom 1.27: 120.13,5.59 126.18,11.63 v126.18,11.82
  Bottom 2.54: 120.13,5.59 82.46,5.59 MOTOR.8
  other vias: 22.14,60.64 20.14,60.64 24.14,60.64 23.14,61.64 21.14,61.64 22.14,62.64 24.14,62.64 20.14,62.64 53.13,61.64 55.13,61.64 54.13,62.64 56.13,60.64 56.13,62.64 52.13,60.64 52.13,62.64 85.14,61.64 87.14,61.64 86.14,62.64 88.14,62.64 88.04,60.64 84.04,60.64 84.14,62.64 21.14,63.54 23.24,63.54 22.24,64.34 53.13,63.54 55.13,63.64 54.13,64.44 85.14,63.54 87.14,63.54 86.14,64.34
  pour Bottom (isolate 1.422, rank 2, no thermals): 109.14,53.14 109.14,22.94 3.93,22.94 1.83,25.04 1.83,80.69 3.83,82.69 22.24,82.69 24.14,80.79 24.14,56.34 27.24,53.24 41.22,53.43 45.03,57.24 45.03,81.19 46.93,83.09 51.84,83.09 55.03,79.89 55.03,57.24 58.84,53.44 73.64,53.44 77.34,57.14 77.34,81.79 78.34,82.79 84.04,82.79 86.14,80.69 86.14,57.84 90.84,53.14
  pour Bottom (isolate 0.61, no thermals): 109.53,53.04 1.83,53.04 1.83,81.29 10.64,90.09 40.34,90.09 43.63,86.79 111.5,86.79 114.3,83.99 119.48,83.99 138.36,102.87 171.9,102.87 177.87,96.9 177.87,7.63 170.82,0.57 123.61,0.57 114.34,9.84 114.34,53.41 122.54,61.62 119.86,64.3 115.25,64.3 109.83,58.87
  pour Top (no thermals): 46.04,52.84 50.55,52.84 52.07,54.37 55.82,54.37 56.83,55.38 56.83,65.22 55.94,66.11 53.09,66.11 46.04,59.06
  pour Top (no thermals): 14.1,52.46 18.61,52.46 20.13,53.98 23.88,53.98 24.89,55 24.89,64.97 24.13,65.73 21.15,65.73 14.1,58.68
  pour Top (no thermals): 78.04,52.65 82.55,52.65 84.07,54.18 87.82,54.18 88.84,55.19 88.84,65.03 87.95,65.92 85.09,65.92 78.04,58.87
HALL_1
  Top 0.508: MOTOR.6 72.24,7.15 73.74,8.65 123.63,8.65 128.84,3.44 152.15,3.44 R42.1
HALL_2
  Top 0.508: MOTOR.5 67.16,8.27 68.92,10.03 124.16,10.03 129.54,4.64 147.95,4.64 R41.1
HALL_3
  Top 0.508: MOTOR.4 62.08,8.39 65.07,11.37 124.65,11.37 130.24,5.79 143.76,5.79 R40.2
HIN1
  Top 0.406: U$1.2 104.33,74.24 105.49,75.4 109.5,75.4 115.07,69.83 115.07,46.29 R23.2
HIN2
  Top 0.406: U$2.2 72.43,74.04 75.85,77.46 111.03,77.46 118.5,69.99 118.5,50.99 R25.2
HIN3
  Top 0.406: U$3.2 40.63,74.04 46.18,79.59 112.56,79.59 121.99,70.16 121.99,55.94 R27.1
HS2
  Top 0.406: R7.2 74.16,61.14
  Top 0.508: 74.16,61.14 Q3.1
HS3
  Top 0.508: R9.2 42.05,57.27 Q5.1
LIN1
  Top 0.406: U$1.3 103.06,74.57 104.88,76.38 110.38,76.38 116.72,70.04 116.72,48.7 R22.2
LIN2
  Top 0.406: U$2.3 71.16,74.44 75.18,78.46 111.93,78.46 120.27,70.12 120.27,53.66 R24.2
LIN3
  Top 0.406: U$3.3 39.36,74.44 45.51,80.59 113.55,80.59 123.71,70.43 123.71,58.29 R26.1
LS1
  Top 0.406: R6.2 91.16,61.16
  Top 0.508: 91.16,61.16 Q2.1
LS2
  Top 0.406: R8.2 59.21,61.16
  Top 0.508: 59.21,61.16 Q4.1
LS3
  Top 0.406: 27.12,61.25 R10.2
  Top 0.508: Q6.1 27.12,61.25
N$1
  Top 0.406: R5.2 106.06,60.95
  Top 0.508: 106.06,60.95 Q1.1
N$2
  Top 0.254: 135.57,27.3 U7.29
  Top 0.305: L1.1 141.48,18.68 135.57,24.59 135.57,27.3
  Top 0.813: 143.64,17.6 C21.1 C4.1 143.9,17.34 143.64,17.6 | 143.64,17.6 L1.1
N$3
  Top 0.406: R6.1 94.28,61.44 96.05,61.44 101.71,67.1 101.71,68.09 U$1.5
N$4
  Top 0.406: 73.69,64.87 C9.1 77.04,64.75 R30.2
  Top 0.508: 73.69,64.87 U$2.8
N$5
  Top 0.406: 104.34,63.64 104.31,63.67 104.31,68.14 U$1.7
  Top 0.508: 104.34,63.64 104.34,63.42 102.94,62.02 R5.1
N$6
  Top 0.254: U7.8 130.42,43.43
  Top 0.305: 130.42,43.43 130.42,51.58 R26.2
N$7
  Top 0.406: R29.1 108.65,68.38 D1.C
N$8
  Top 0.406: C7.1 R29.2
  Top 0.508: U$1.8 105.59,65.36 C7.1
N$9
  Top 0.254: 129.59,43.55 U7.9
  Top 0.305: 129.59,43.55 129.59,48.34 R27.2
N$10
  Top 0.254: 72.44,68.13 72.44,63.1
  Top 0.406: R7.1 71.04,61.71 72.44,63.1 | 72.44,68.13 U$2.7
N$11
  Top 0.406: R8.1 64.05,61.32 69.88,67.14 U$2.5
N$12
  Top 0.254: 146.57,44.66 U7.61
  Top 0.305: JP1.2 146.57,47.63 146.57,44.66
  Top 1.016: R28.2 JP1.2
N$13
  Top 0.508: IC1.2 80.38,95.42 80.18,95.62 R2.2 78.1,96.07 | 78.1,96.07 C33.1 | R3.1 77.98,95.95 78.1,96.07
N$14
  Top 0.406: R4.2 85.5,98.54 85.5,94.59 85.06,94.15 IC1.3
  Top 0.508: IC1.3 80.72,94.15 R11.1
N$15
  Top 0.406: 41.89,64.78 C10.1 45.27,64.69 R31.2
  Top 0.508: U$3.8 41.89,64.78
N$16
  Top 0.61: Q8.1 102.43,86.81 101.22,88.02 101.22,90.69 103.76,93.23 Q9.1 102.92,97.61 97.73,97.61 | IC1.7 90.53,95.42 92.71,97.61 97.73,97.61 | R35.1 97.73,95.82 97.73,97.61
N$17
  Top 0.254: 40.63,63.1 40.63,66.24
  Top 0.406: 40.63,63.1 39.21,61.67 R9.1 | 40.63,66.24 40.63,68.23 U$3.7
N$18
  Top 0.406: U$3.5 38.08,67.2 32.3,61.43 R10.1
N$19
  Top 0.406: R30.1 76.85,67.79 D2.C
N$20
  Top 0.254: 135,27.44 U7.28
  Top 0.305: L2.1 140.08,18.69 140.08,19.12 135,24.2 135,27.44
  Top 0.813: 138.97,14.71 C19.1 C18.1 140.05,14.71 138.97,14.71 | 138.97,14.71 L2.1
N$21
  Top 0.813: 82.23,97.16 82.7,96.69 IC1.1
  Top 1.016: C33.2 78.1,98.91 R2.1 80.21,98.94 82.23,98.94 | 82.23,98.94 82.23,99.05 85.11,101.93 120.45,101.93 126.62,95.76 126.62,59.7 136.78,49.54 136.78,47.59 R12.2 | 82.23,98.94 82.23,97.16
N$22
  Top 1.016: IC2.2 148.28,98.18 147.32,99.13 142.81,99.13 141.32,97.65 D5.C 141.32,88.86 L4.1
N$23
  Top 0.254: 128.01,42.3 U7.13
  Top 0.305: R22.1 123.13,42.3 128.01,42.3
N$24
  Top 0.254: 128.07,41.54 U7.14
  Top 0.305: R23.1 119.82,41.54 128.07,41.54
N$25
  Top 0.254: 128.76,43.68 U7.10
  Top 0.305: R24.1 128.76,45.17 128.76,43.68
N$26
  Top 0.254: 128.02,43 U7.12
  Top 0.305: R25.1 126.49,43 128.02,43
N$27
  Top 0.406: R31.1 44.85,67.96 D3.C
N$28
  Top 0.406: R32.1 164.15,36.39 | 164.15,33.4 U$4.8
  Top 0.508: 164.15,36.39 164.15,33.4
N$29
  Top 0.254: R35.2 IC1.5
  Top 0.406: R35.2
  Top 0.508: R34.1 R35.2 R36.2
N$30
  Top 0.508: U$4.7 165.79,32.13 166.6,32.94 R33.2 170.14,32.94 CANBUS1.3
N$31
  Top 1.016: Q7.2 120.02,87.47 118.48,89.01 RESISTOR.1
N$32
  Top 0.508: U$4.6 165.74,30.86 166.44,30.16 166.75,30.16 R33.1 170.3,30.1 CANBUS1.2
N$33
  Top 0.61: IC1.6 92.34,94.15 R37.1 R38.2
N$34
  Top 0.61: Q8.2 104.97,86.79 105.66,87.49 Q9.2 106.66,96.76 107.59,97.7 R39.1
N$35
  Top 0.61: R39.2 108.4,89.43 Q7.1
N$36
  Top 0.254: U7.41 146.22,27.63 149.28,27.63
  Top 0.508: R40.1 C42.1 149.28,27.63
N$37
  Top 0.254: U7.42 145.91,28.65 150.11,28.65
  Top 0.508: 150.11,28.65 154.56,24.2 161.04,24.2 162.12,23.12 162.12,21.35 160.05,19.28 C43.1 R41.2
N$38
  Top 0.254: U7.43 145.66,29.6 151,29.6
  Top 0.508: 151,29.6 155.13,25.47 161.73,25.47 164.72,22.49 164.72,18.49 162.78,16.55 C44.1 R42.2
PHASE_A  (via drill 0.4)
  Top 0.508: Q1.3 100.98,63.04 102.94,65 C7.2 103.05,65.31 U$1.6
  Top 0.813: v83.27,13.97 83.4,13.84 125.24,13.84 130.61,19.21 R20.2
  Bottom 0.813: 80.94,15.74 81.34,15.74
  Bottom 1.27: v83.27,13.97 81.42,15.83
  Bottom 2.54: MOTOR.3 57,10.41 62.34,15.74 80.94,15.74 | 81.34,15.74 81.42,15.83 88.09,22.5
  other vias: 84.64,39.64 83.64,38.64 83.64,40.64 85.64,38.64 84.64,41.64 85.64,40.64 86.64,39.64 86.64,41.64 87.64,40.64 88.64,41.64 88.64,39.64 89.64,40.64 90.64,41.64 87.64,38.64 89.64,38.64 90.64,39.64 91.64,38.64 92.64,41.64 91.64,40.64 92.64,39.64 93.64,40.64 93.64,38.64
  pour Top (isolate 1.422, no thermals): 101.54,55.34 99.64,53.44 97.64,53.44 93.23,49.04 84.64,49.04 83.23,50.44 84.84,52.04 91.34,52.04 96.23,56.94 96.23,58.94 101.54,58.94
  pour Top (isolate 2.184, rank 2, no thermals): 93.84,37.94 83.44,37.94 83.44,42.84 93.84,42.84
  pour Bottom (isolate 2.184, no thermals): 86.64,20.14 83.44,23.34 83.44,43.24 93.84,43.24 93.84,27.34
PHASE_B  (via drill 0.4)
  Top 0.406: U$2.6 71.15,64.89 C9.2 68.94,62.68 68.94,58.34 66.94,56.34 66.64,56.34 66.64,57.74 68.59,57.74 Q3.3
  Top 0.813: R18.2 125.9,23.82 118.31,16.23 57.61,16.23 v57.45,16.38
  Bottom 1.27: v57.45,16.38 55.86,17.97
  Bottom 2.54: MOTOR.2 51.92,14.03 55.86,17.97 61.27,23.38 61.28,23.38 61.28,41 v60.63,41.64
  other vias: 52.53,41.64 54.63,41.64 56.63,41.64 58.63,41.64 61.63,40.64 59.63,40.64 57.63,40.64 55.63,40.64 53.53,40.64 52.53,39.64 54.63,39.64 56.63,39.64 58.63,39.64 60.63,39.64 61.63,38.64 59.63,38.64 57.63,38.64 55.63,38.64 53.63,38.64 51.63,40.64 51.63,38.64
  pour Top (isolate 1.422, no thermals): 69.54,55.44 67.64,53.54 65.64,53.54 61.23,49.14 52.63,49.14 51.38,50.39 53.13,52.14 59.34,52.14 64.14,56.94 64.14,59.04 69.54,59.04
  pour Bottom (isolate 2.184, no thermals): 57.84,19.14 55.88,19.14 51.34,23.68 51.34,43.24 62.18,43.24 62.18,23.49
  pour Top (isolate 2.184, rank 2, no thermals): 61.84,37.94 51.53,37.94 51.53,43.64 61.84,43.64
  pour Top (isolate 2.184, rank 2, no thermals): 61.73,37.94 51.43,37.94 51.43,43.64 61.73,43.64
PHASE_C  (via drill 0.4)
  Top 0.406: U$3.6 39.35,64.86 C10.2 37.21,62.73 37.02,62.14 Q5.3
  Top 0.813: v46.13,15.34 49.41,18.62 111.18,18.62 R16.2
  Bottom 1.27: v46.13,15.34 44.73,13.94 | 26.61,21.45 25.64,22.42 v25.64,38.54
  Bottom 2.54: MOTOR.1 46.84,11.84 44.73,13.94 43.43,15.24 32.81,15.24 26.61,21.45
  other vias: 20.54,41.64 22.64,41.64 24.64,41.64 26.64,41.64 28.64,41.64 29.57,40.64 27.64,40.64 25.64,40.64 23.64,40.64 21.64,40.54 19.64,40.64 20.64,39.64 22.64,39.64 24.64,39.54 26.64,39.54 28.74,39.54 27.64,38.52 23.64,38.54 21.64,38.54 19.64,38.54 29.57,38.55
  pour Top (isolate 1.422, no thermals): 37.43,55.34 35.53,53.44 33.53,53.44 29.14,49.04 20.54,49.04 19.14,50.44 20.74,52.04 27.24,52.04 32.23,57.04 32.23,58.94 37.43,58.94
  pour Bottom (isolate 2.184, no thermals): 26.84,20.54 26.64,20.54 19.44,27.74 19.44,43.54 29.74,43.54 29.74,23.44
  pour Top (isolate 2.184, rank 2, no thermals): 29.74,38.14 19.24,38.14 19.24,43.54 29.74,43.54
RESET  (via drill 0.35)
  Top 0.254: 131.18,43.38 U7.7
  Top 0.305: 141.1,63.66 S1.2 | 131.18,43.38 131.18,44.96 v134.94,48.71 | v137.35,51.13 137.37,51.15 C20.1 138.26,53.34 D4.1 140.68,55.01 141.1,55.42 S1.1
  Top 0.406: v157.92,59.83 157.95,59.8
  Top 0.508: STLINK.4 165.48,59.3 164.97,59.8 157.95,59.8 | v153.22,59.83 141.75,59.83 S1.1 | R1.1 141.12,63.64 141.1,63.66
  Top 0.813: S1.1 141.1,63.66
  Bottom 0.305: v137.35,51.13 v134.94,48.71
  Bottom 0.508: v157.92,59.83 v153.22,59.83
SWCLK
  Top 0.254: STLINK.3 165.3,56.76 164.18,55.64 164.18,54.5 U7.50
SWDIO
  Top 0.254: STLINK.2 164.61,54.22 U7.49
TTL_RX  (via drill 0.35)
  Top 0.254: v150.62,42.3 150.57,42.3 U7.52
  Top 0.508: USB-TTL.2 v154.44,42.3 v154.43,42.3
  Bottom 0.508: v154.43,42.3 v150.62,42.3
TTL_TX  (via drill 0.35)
  Top 0.254: U7.53 148.65,41.09 148.65,41.79 150.37,43.51 v151.64,43.51
  Top 0.508: v155.26,43.51 155.32,43.44 163.96,43.44 165.35,44.84 USB-TTL.3
  Bottom 0.508: v155.26,43.51 v151.64,43.51
VCC  (via drill 0.35, 0.4)
  Top 0.406: Q5.2 39.75,46.34 42.34,46.34 42.84,45.84 42.84,39.34 49.34,32.84 | Q3.2 72.64,45.55 72.64,39.54 72.73,39.44 | Q1.2 103.54,46.35 103.54,39.94 98.23,34.64
  Top 1.016: IC2.1 149.42,99.88 148.12,101.18
  Top 1.27: 148.12,101.18 139.27,101.18 138.34,100.24 C3.1 133.3,100.19 126.7,100.19 v126.64,100.13 | v102.17,94.8 101.25,95.72 R34.2 | 50.77,94.82 54.9,98.95 U5.VIN | 50.77,94.82 v54.42,94.82 | C45.1 47.21,91.54 44.96,93.8 | 30.42,93.8 44.96,93.8 | 50.77,94.82 45.97,94.82 44.96,93.8
  Bottom 1.27: v126.64,100.13 121.31,94.8 113.28,94.8 | 113.28,94.8 v102.17,94.8 102.11,94.86 54.46,94.86 v54.42,94.82 | 113.28,94.8 113.28,98.55 RESISTOR.2
  pour Top (isolate 1.422, rank 3, no thermals): 109.5,22.04 1.74,22.04 1.74,98.91 5.52,102.69 31.14,102.69 34.73,99.09 34.73,82.73 12.57,60.57 12.57,51.91 13.9,50.58 107.23,51.54 109.34,51.54
VIN(-)  (via drill 0.4)
  Top 0.813: R3.2 v77.98,89.19
  Bottom 0.508: v77.98,89.19 77.98,89.09
  Bottom 0.813: RSHUNT.1 41.82,91.34 44.67,88.49 77.38,88.49 77.98,89.09
  Bottom 1.016: 37.93,97.73 37.83,97.63 RSHUNT.1
  pour Bottom (isolate 1.422, no thermals): 39.23,91.49 39.23,100.89 36.53,100.89 36.53,91.49
VIRTUAL_GND
  Top 0.254: 132.91,27.39 134.29,28.77 134.92,28.77 U7.26 136.72,30.57 | U7.30 137.99,29.01 | 134.17,32.97 133.44,32.24 U7.19 128.5,27.3 R14.1
  Top 0.305: 132.91,27.39 132.91,22.04 R15.1 | 134.17,32.97 134.87,32.97 136.72,31.12 136.72,30.57 137.27,30.57 137.99,29.85 137.99,29.01 | R13.1 128.5,26.37 R14.1

### Text on the board
tPlace: RESIS | V+ | V- | +3.3V | RESET | SWCLK | SWDIO | GND | +5V | TTL_TX | TTL_RX | GND | CANH | CANL | GND | C | B | A | ZC | ZB | ZA | 5V | GND